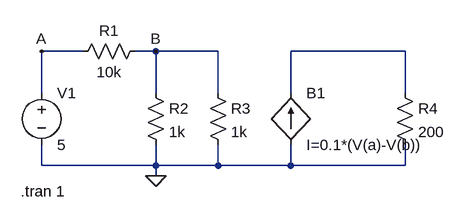
[diagram p0: schematic aula04-1.asc]
aula04-1.asc, the LTspice schematic file:
Version 4
SHEET 1 880 680
WIRE -32 64 -96 64
WIRE 80 64 48 64
WIRE 176 64 80 64
WIRE 464 64 288 64
WIRE -96 128 -96 64
WIRE 80 128 80 64
WIRE 176 128 176 64
WIRE 288 128 288 64
WIRE 464 128 464 64
WIRE -96 240 -96 208
WIRE 80 240 80 208
WIRE 80 240 -96 240
WIRE 176 240 176 208
WIRE 176 240 80 240
WIRE 288 240 288 208
WIRE 288 240 176 240
WIRE 464 240 464 208
WIRE 464 240 288 240
WIRE 80 256 80 240
FLAG 80 256 0
FLAG -96 64 A
FLAG 80 64 B
SYMBOL bi2 288 128 R0
SYMATTR InstName B1
SYMATTR Value I=0.1*(V(a)-V(b))
SYMBOL voltage -96 112 R0
WINDOW 123 0 0 Left 0
WINDOW 39 0 0 Left 0
SYMATTR InstName V1
SYMATTR Value 5
SYMBOL res 64 48 R90
WINDOW 0 0 56 VBottom 2
WINDOW 3 32 56 VTop 2
SYMATTR InstName R1
SYMATTR Value 10k
SYMBOL res 64 112 R0
SYMATTR InstName R2
SYMATTR Value 1k
SYMBOL res 160 112 R0
SYMATTR InstName R3
SYMATTR Value 1k
SYMBOL res 448 112 R0
SYMATTR InstName R4
SYMATTR Value 200
TEXT -128 280 Left 2 !.tran 1

The netlist it stands for:
* aula04-1.asc
B1 0 N001 I=0.1*(V(a)-V(b))
V1 A 0 5
R1 B A 10k
R2 B 0 1k
R3 B 0 1k
R4 N001 0 200
.tran 1
.backanno
.end